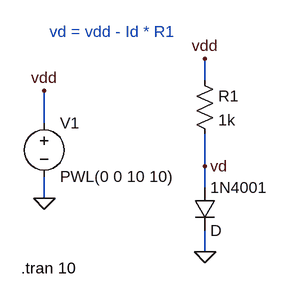
[diagram p0: schematic diyod.asc]
diyod.asc, the LTspice schematic file:
Version 4
SHEET 1 880 680
WIRE 336 32 336 0
WIRE 96 96 96 48
WIRE 336 160 336 112
WIRE 336 192 336 160
WIRE 96 208 96 176
WIRE 336 288 336 256
FLAG 96 208 0
FLAG 336 288 0
FLAG 336 0 vdd
FLAG 96 48 vdd
FLAG 336 160 vd
SYMBOL voltage 96 80 R0
WINDOW 123 0 0 Left 0
WINDOW 39 0 0 Left 0
SYMATTR InstName V1
SYMATTR Value PWL(0 0 10 10)
SYMBOL res 320 16 R0
SYMATTR InstName R1
SYMATTR Value 1k
SYMBOL diode 320 192 R0
SYMATTR InstName 1N4001
TEXT 62 312 Left 2 !.tran 10
TEXT 104 -40 Left 2 ;vd = vdd - Id * R1

The netlist it stands for:
* diyod.asc
V1 vdd 0 PWL(0 0 10 10)
R1 vdd vd 1k
D§1N4001 vd 0 D
.model D D
.lib standard.dio
.tran 10
* vd = vdd - Id * R1
.backanno
.end